# EasyEDA Pro project ProProject_Stc32f_Car副本_2024-06-03.epro, schematic stc32g
Create Date: 2024-04-19; Page Name: P1; Project Name: Stc32f_Car; Schematic Name: STC32G; Update Date: 2024-04-19; Company: 嘉立创EDA; Page Size: A4; Version: V1.0
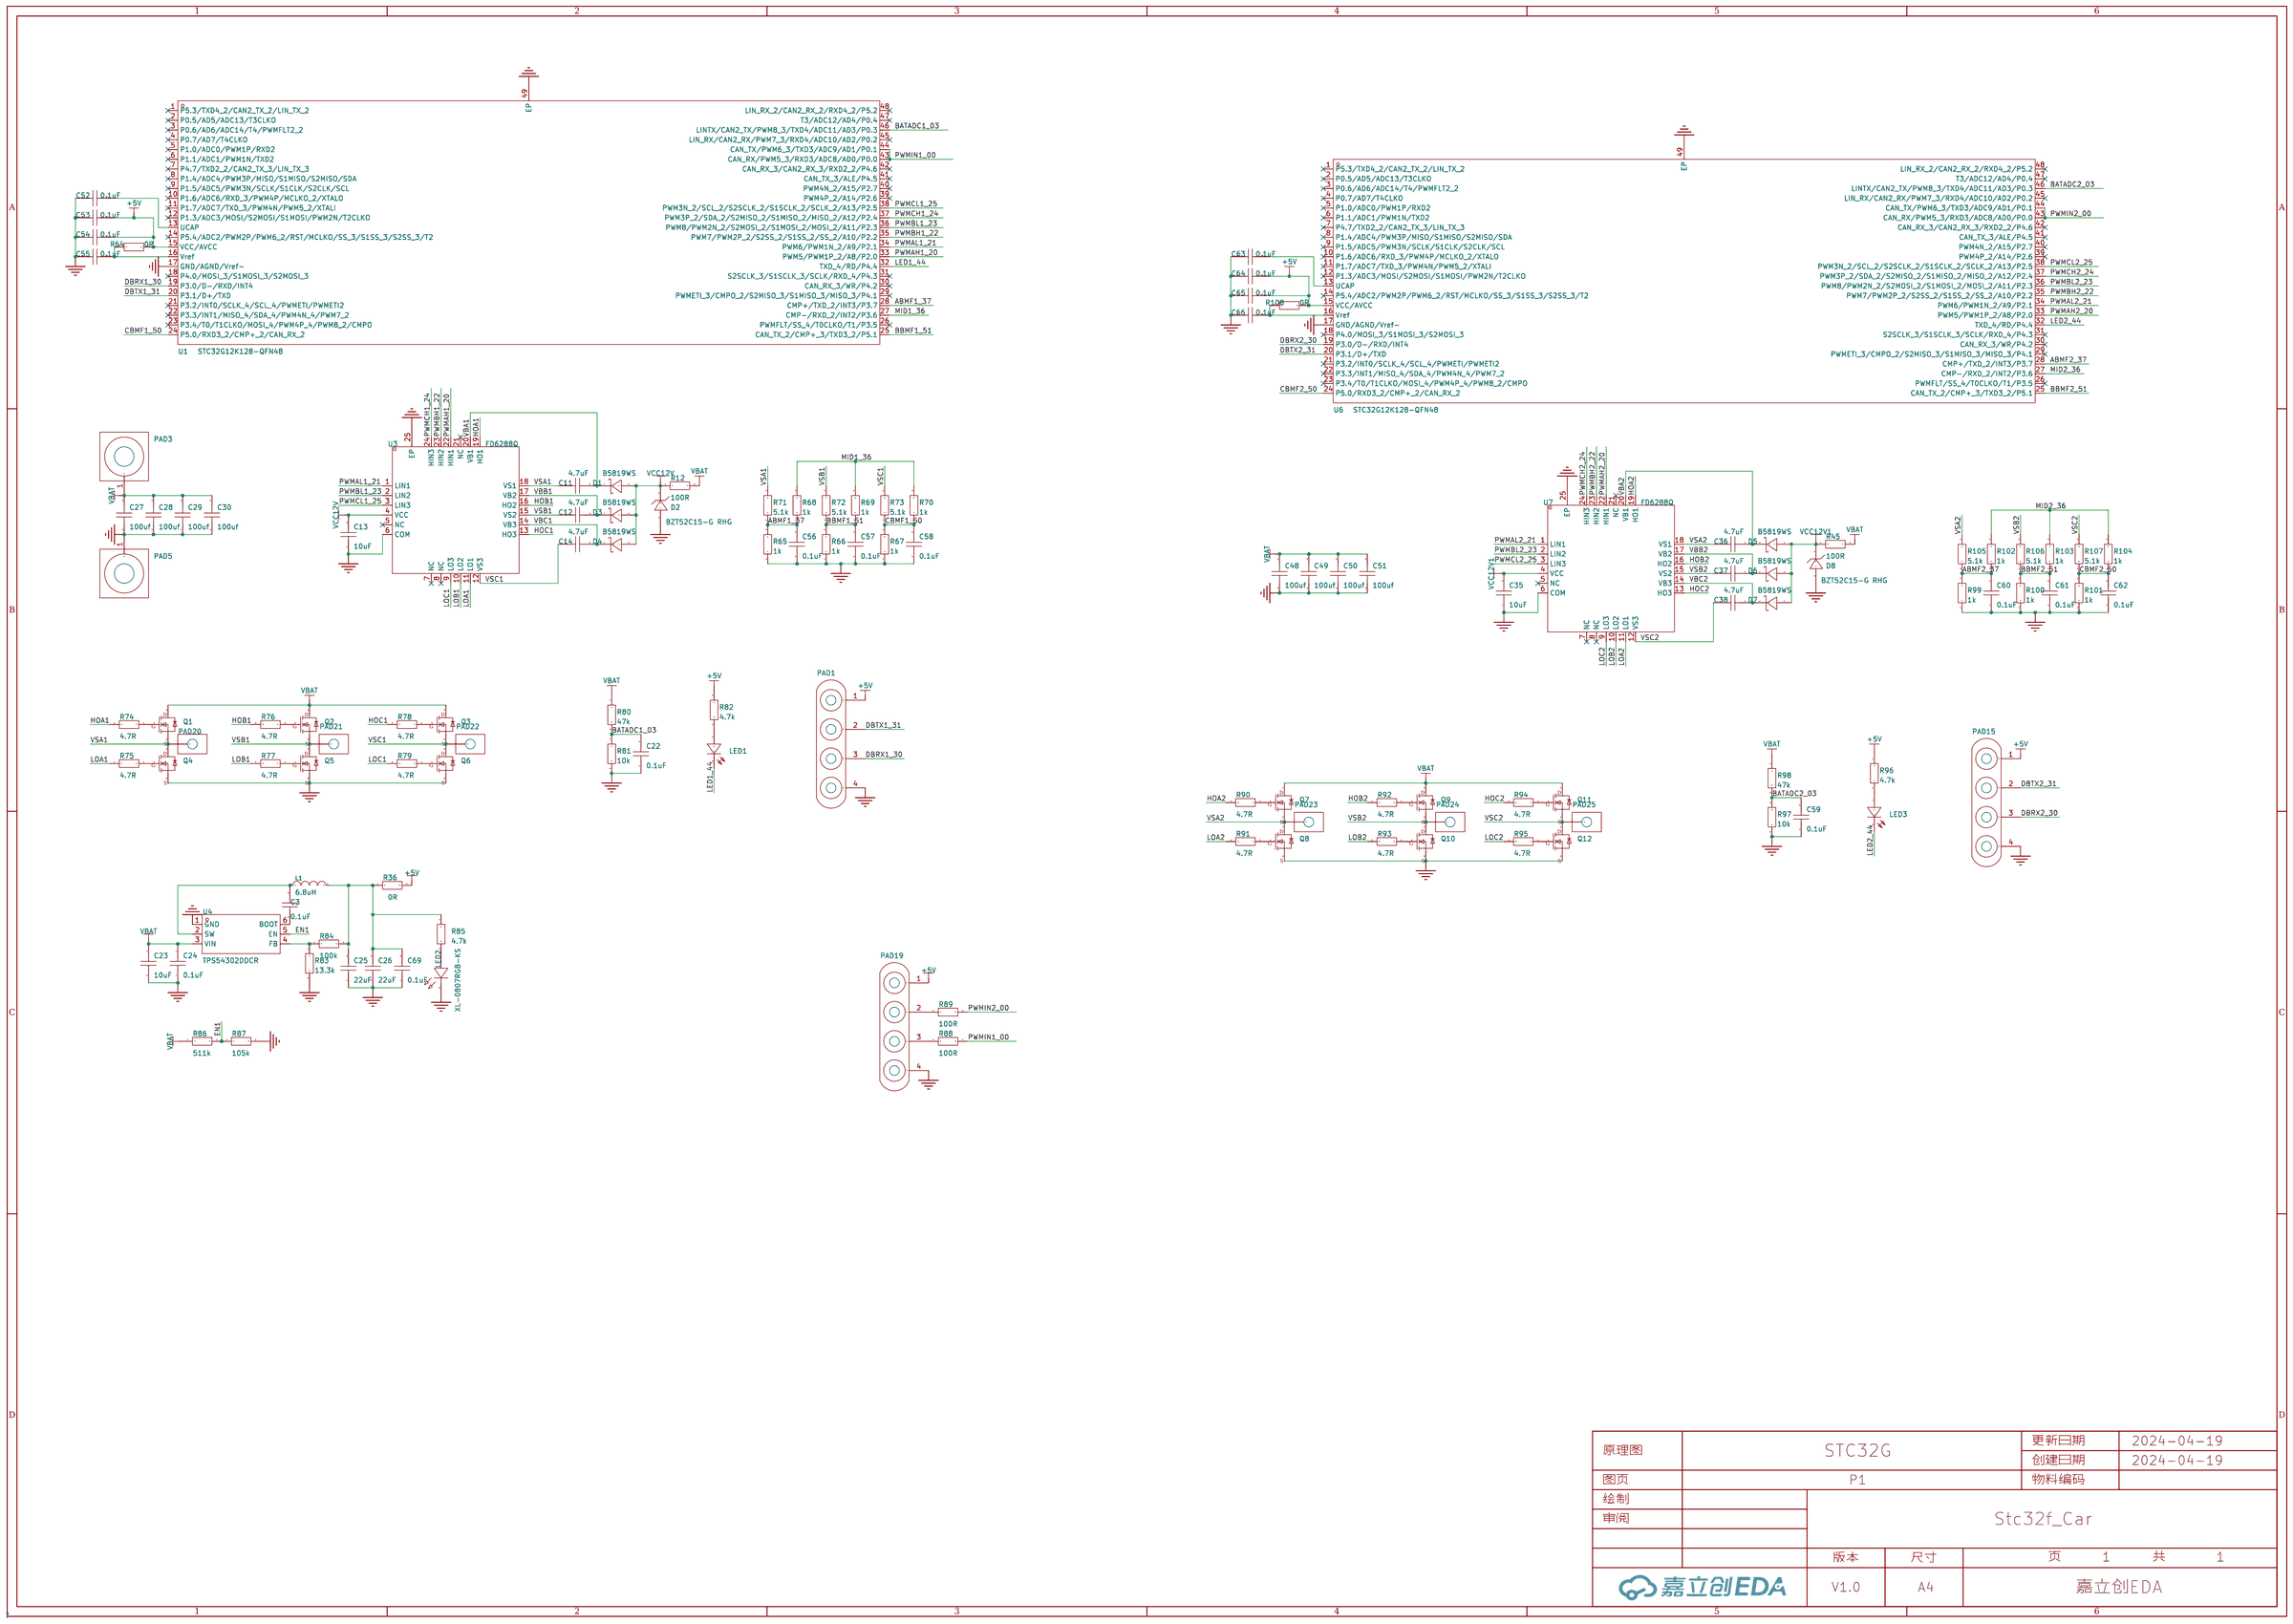
[diagram p9: schematic sheet]

## Parts
C3  0.1uF  [CAPC1005[0402]S-N]
C11  4.7uF  [CAPC1608[0603]S-N_1]
C12  4.7uF  [CAPC1608[0603]S-N_1]
C13  10uF  [CAPC1608[0603]S-N_1]
C14  4.7uF  [CAPC1608[0603]S-N_1]
C22  0.1uF  [CAPC1005[0402]S-N]
C23  10uF  [C 0603_M]
C24  0.1uF  [CAPC1005[0402]S-N]
C25  22uF  [C 0805_M]
C26  22uF  [C 0805_M]
C27  100uf  [C1210]
C28  100uf  [C1210]
C29  100uf  [C1210]
C30  100uf  [C1210]
C35  10uF  [CAPC1608[0603]S-N_1]
C36  4.7uF  [CAPC1608[0603]S-N_1]
C37  4.7uF  [CAPC1608[0603]S-N_1]
C38  4.7uF  [CAPC1608[0603]S-N_1]
C48  100uf  [C1210]
C49  100uf  [C1210]
C50  100uf  [C1210]
C51  100uf  [C1210]
C52  0.1uF  [CAPC1005[0402]S-N]
C53  0.1uF  [CAPC1005[0402]S-N]
C54  0.1uF  [CAPC1005[0402]S-N]
C55  0.1uF  [CAPC1005[0402]S-N]
C56  0.1uF  [CAPC1005[0402]S-N]
C57  0.1uF  [CAPC1005[0402]S-N]
C58  0.1uF  [CAPC1005[0402]S-N]
C59  0.1uF  [CAPC1005[0402]S-N]
C60  0.1uF  [CAPC1005[0402]S-N]
C61  0.1uF  [CAPC1005[0402]S-N]
C62  0.1uF  [CAPC1005[0402]S-N]
C63  0.1uF  [CAPC1005[0402]S-N]
C64  0.1uF  [CAPC1005[0402]S-N]
C65  0.1uF  [CAPC1005[0402]S-N]
C66  0.1uF  [CAPC1005[0402]S-N]
C69  0.1uF  [CAPC1005[0402]S-N]
D1  B5819WS  [SOD-323_L1.8-W1.3-LS2.5-RD]
D2  BZT52C15-G RHG  [SOD-123_L2.8-W1.8-LS3.7-RD]
D3  B5819WS  [SOD-323_L1.8-W1.3-LS2.5-RD]
D4  B5819WS  [SOD-323_L1.8-W1.3-LS2.5-RD]
D5  B5819WS  [SOD-323_L1.8-W1.3-LS2.5-RD]
D6  B5819WS  [SOD-323_L1.8-W1.3-LS2.5-RD]
D7  B5819WS  [SOD-323_L1.8-W1.3-LS2.5-RD]
D8  BZT52C15-G RHG  [SOD-123_L2.8-W1.8-LS3.7-RD]
L1  6.8uH  [L1008]
LED1  77fc373f7f6b4e3da7045e8b6ad0bd9c  [LED Chip]
LED2  XL-0807RGB-KS  [LED-SMD_L2.0-W1.8-R-RD]
LED3  77fc373f7f6b4e3da7045e8b6ad0bd9c  [LED Chip]
PAD1  -  [小焊盘4pin]
PAD3  -  [外置焊盘]
PAD5  -  [外置焊盘]
PAD15  -  [小焊盘4pin]
PAD19  -  [HDR1X4-TP]
PAD20  -  [WirePad-4x6 bottom]
PAD21  -  [WirePad-4x6 bottom]
PAD22  -  [WirePad-4x6 bottom]
PAD23  -  [WirePad-4x6 bottom]
PAD24  -  [WirePad-4x6 bottom]
PAD25  -  [WirePad-4x6 bottom]
Q1  -  [MLPAK33-8_L3.2-W3.0-P0.65-LS3.3-BL]
Q2  -  [MLPAK33-8_L3.2-W3.0-P0.65-LS3.3-BL]
Q3  -  [MLPAK33-8_L3.2-W3.0-P0.65-LS3.3-BL]
Q4  -  [MLPAK33-8_L3.2-W3.0-P0.65-LS3.3-BL]
Q5  -  [MLPAK33-8_L3.2-W3.0-P0.65-LS3.3-BL]
Q6  -  [MLPAK33-8_L3.2-W3.0-P0.65-LS3.3-BL]
Q7  -  [MLPAK33-8_L3.2-W3.0-P0.65-LS3.3-BL]
Q8  -  [MLPAK33-8_L3.2-W3.0-P0.65-LS3.3-BL]
Q9  -  [MLPAK33-8_L3.2-W3.0-P0.65-LS3.3-BL]
Q10  -  [MLPAK33-8_L3.2-W3.0-P0.65-LS3.3-BL]
Q11  -  [MLPAK33-8_L3.2-W3.0-P0.65-LS3.3-BL]
Q12  -  [MLPAK33-8_L3.2-W3.0-P0.65-LS3.3-BL]
R12  100R  [RESC1608[0603]S-N_1]
R36  0R  [R 0805_M_1]
R45  100R  [RESC1608[0603]S-N_1]
R64  0R  [RESC1005[0402]S-N]
R65  1k  [RESC1005[0402]S-N]
R66  1k  [RESC1005[0402]S-N]
R67  1k  [RESC1005[0402]S-N]
R68  1k  [RESC1005[0402]S-N]
R69  1k  [RESC1005[0402]S-N]
R70  1k  [RESC1005[0402]S-N]
R71  5.1k  [RESC1005[0402]S-N]
R72  5.1k  [RESC1005[0402]S-N]
R73  5.1k  [RESC1005[0402]S-N]
R74  4.7R  [RESC1005[0402]S-N]
R75  4.7R  [RESC1005[0402]S-N]
R76  4.7R  [RESC1005[0402]S-N]
R77  4.7R  [RESC1005[0402]S-N]
R78  4.7R  [RESC1005[0402]S-N]
R79  4.7R  [RESC1005[0402]S-N]
R80  47k  [RESC1005[0402]S-N]
R81  10k  [RESC1005[0402]S-N]
R82  4.7k  [RESC1005[0402]S-N]
R83  13.3k  [RESC1005[0402]S-N]
R84  100k  [RESC1005[0402]S-N]
R85  4.7k  [RESC1005[0402]S-N]
R86  511k  [RESC1005[0402]S-N]
R87  105k  [RESC1005[0402]S-N]
R88  100R  [RESC1005[0402]S-N]
R89  100R  [RESC1005[0402]S-N]
R90  4.7R  [RESC1005[0402]S-N]
R91  4.7R  [RESC1005[0402]S-N]
R92  4.7R  [RESC1005[0402]S-N]
R93  4.7R  [RESC1005[0402]S-N]
R94  4.7R  [RESC1005[0402]S-N]
R95  4.7R  [RESC1005[0402]S-N]
R96  4.7k  [RESC1005[0402]S-N]
R97  10k  [RESC1005[0402]S-N]
R98  47k  [RESC1005[0402]S-N]
R99  1k  [RESC1005[0402]S-N]
R100  1k  [RESC1005[0402]S-N]
R101  1k  [RESC1005[0402]S-N]
R102  1k  [RESC1005[0402]S-N]
R103  1k  [RESC1005[0402]S-N]
R104  1k  [RESC1005[0402]S-N]
R105  5.1k  [RESC1005[0402]S-N]
R106  5.1k  [RESC1005[0402]S-N]
R107  5.1k  [RESC1005[0402]S-N]
R108  0R  [RESC1005[0402]S-N]
U1  STC32G12K128-QFN48  [QFN-48_L6.0-W6.0-P0.40-TL-EP4.1]
U3  FD6288Q  [QFN-24_L4.0-W4.0-P0.50-BL-EP2.6]
U4  TPS54302DDCR  [SOT-23-6_L2.9-W1.6-P0.95-LS2.8-BL]
U6  STC32G12K128-QFN48  [QFN-48_L6.0-W6.0-P0.40-TL-EP4.1]
U7  FD6288Q  [QFN-24_L4.0-W4.0-P0.50-BL-EP2.6]

## Library data of the parts
C3 C22 C24 C52-C66 C69 = C_0402L
C11-C14 C35-C38 = C_0603L
C23 = C_0603: Published: 2020-12-18; Revision: V1.1; Tolerance: ±10%; Voltage: 50V; Origin Footprint 2: CAPC1310[0504]S; Origin Footprint 3: CAPC3216[1206]S; Origin Footprint 4: CAPC3225[1210]S; Origin Footprint 5: CAPC4532[1812]S; Origin Footprint 6: CAPC4564[1825]S; Origin Footprint 7: CAPC2012[0805]; Origin Footprint 8: CAPC3216[1206]; Origin Footprint 9: CAPC3225[1210]; Origin Footprint 10: CAPC4532[1812]; Origin Footprint 11: CAPC4564[1825]; Origin Footprint 12: CAPC1608[0603]-N; Origin Footprint 13: CAPC1608[0603]-L; Origin Footprint 14: CAPC1608[0603]-M; Origin Footprint 15: CAPC1608[0603]S-L; Origin Footprint 16: CAPC1608[0603]S-M; Origin Footprint 17: CAPC1608[0603]S-N; Origin Footprint 18: CAPC1005[0402]-L; Origin Footprint 19: CAPC1005[0402]-M; Origin Footprint 20: CAPC1005[0402]-N; Origin Footprint 21: CAPC1005[0402]S-L; Origin Footprint 22: CAPC1005[0402]S-M; Origin Footprint 23: CAPC1005[0402]S-N; Origin Footprint 24: CAPC2012[0805]S-L; Origin Footprint 25: CAPC2012[0805]S-M; Origin Footprint 26: CAPC2012[0805]S-N
C25 C26 = C_0805
C27-C30 C48-C51 = 1210: Supplier Part: C9900018278; JLCPCB Part Class: 扩展库; Supplier: LCSC
D1 D3-D7 = B5819WS_C64886: 直流反向耐压(Vr):40V;平均整流电流(Io):1A;正向压降(Vf):600mV@1A;; LCSC Part Name: B5819WS SL; Supplier Part: C64886; Manufacturer: MDD; Supplier Footprint: SOD-323; JLCPCB Part Class: 扩展库; Datasheet: https://atta.szlcsc.com/upload/public/pdf/source/20190305/C64886_1F90AE208F3ADE51A810479320F68578.pdf; Supplier: LCSC; Reverse Voltage (Vr): 40V; Average Rectified Current (Io): 1A; Forward Voltage (Vf@If): 600mV@1A
D2 D8 = BZT52C15-G RHG: 二极管配置:独立式;稳压值(标称值):15V;稳压值(范围):13.8V~15.6V;精度:±5%;功率:350mW;; Supplier Part: C410856; Manufacturer: Taiwan Semiconductor(台湾半导体); Supplier Footprint: SOD-123; JLCPCB Part Class: 扩展库; Datasheet: https://atta.szlcsc.com/upload/public/pdf/source/20190812/C410856_5A99560BF0F7FC33003834DE7705F091.pdf; Supplier: LCSC; Diode Configuration: 独立式; Zener Voltage (Nom): 15V; Zener Voltage (Range): 13.8V~15.6V; Tolerance: ±5%; Power Dissipation: 350mW; Reverse Leakage Current (Ir): 100nA@10.5V; Zener Impedance (Zzt): 30Ω
L1 = LQM2HPN2R2MG0L: 额定电流:1.3A;电感值:2.2uH;精度:±20%;直流电阻(DCR):100mΩ;; LCSC Part Name: 2.2uH ±20%; Supplier Part: C86092; Manufacturer: muRata(村田); Supplier Footprint: 1008; JLCPCB Part Class: 扩展库; Supplier: LCSC; Rated Current: 1.3A; Tolerance: ±20%; DC Resistance (DCR): 100mΩ
LED1 LED3 = LED Chip: Published: 8-Jun-2000; Revision: July-2002: Re-released for DXP Platform.; Publisher: Altium Limited; Price(RMB): 0.00; Origin Footprint 2: LEDC1608(0603); Origin Footprint 3: LEDC2012(0805); Origin Footprint 4: LEDC3216(1206); Origin Footprint 5: LEDC2012(0805)-L; Origin Footprint 6: LEDC3216(1204); Origin Footprint 7: LEDC3528-2
LED2 = XL-0807RGB-KS: 发光颜色:RGB三色;二极管配置:-;主波长:510nm~525nm；463nm~473nm；620nm~625nm;色温:6000K~6500K;功率:-;安装方式:正贴;; LCSC Part Name: RGB三色 正贴 色温6000K~6500K 快闪 停产; Supplier Part: C965894; Manufacturer: XINGLIGHT(成兴光); Supplier Footprint: SMD,1.8x2mm; JLCPCB Part Class: 扩展库; Datasheet: https://atta.szlcsc.com/upload/public/pdf/source/20221102/EF66E4764A6E96A91069A6ED137C52FB.pdf; Supplier: LCSC; Emitted Color: RGB三色; Lens Color: 无色透明; Dominant Wavelength: 510nm~525nm；463nm~473nm；620nm~625nm; Peak Wavelength: 525nm；625nm；473nm; Color Temperature: 6000K~6500K; Forward Current: 60mA; Viewing Angle: 120°; Mounting Sytle: 正贴; Operating Temperature: -25℃~+60℃
PAD1 PAD15 PAD19 = 小焊盘4pin
PAD3 PAD5 = 外置焊盘
PAD20-PAD25 = 电机焊盘
Q1-Q12 = NMOS-MLPAK(3.3x3.3): PXN8R3-30QLJ; Origin Footprint 2: DFN5x6; Origin Footprint 3: CSD18537NQ5A
R12 R45 = R_0603: BOM____: 贴片电阻; Origin Footprint 2: R 0603_M; Origin Footprint 3: R 0805_M
R36 = R_0805: BOM____: 贴片电阻; Origin Footprint 2: R 0603_M; Origin Footprint 3: R 0805_M
R64-R108 = R_0402L
U1 U6 = STC32G12K128-QFN48: Supplier Part: C9900073965; Supplier Footprint: QFN48_6X6mm; JLCPCB Part Class: 扩展库; Supplier: LCSC
U3 U7 = FD6288Q: Supplier Part: C328453; Manufacturer: Fortior Tech(峰岹); Supplier Footprint: QFN-24-EP(4x4); JLCPCB Part Class: 扩展库; Datasheet: https://atta.szlcsc.com/upload/public/pdf/source/20181108/C328453_785547738DB9FC0123219FC22539EFAD.pdf; Supplier: LCSC; NO_CONNECT: yes
U4 = TPS54302DDCR: 功能类型:降压型;输出类型:可调;输入电压:4.5V~28V;输出电压:596mV~28V;输出电流(最大值):3A;; LCSC Part Name: 降压型 输入4.5V~28V 输出596mV~28V 3A; Supplier Part: C311983; Manufacturer: TI(德州仪器); Supplier Footprint: TSOT-23-6; JLCPCB Part Class: 扩展库; Datasheet: https://atta.szlcsc.com/upload/public/pdf/source/20181023/C311983_0948EE70BFAD2011B492BD3F4CEA709D.pdf; Supplier: LCSC; Function: 降压型; Synchronous Rectification: 是; Output Type: 可调; Number of Outputs: 1; Topology: 降压式; Input Voltage: 4.5V~28V; Output Voltage: 596mV~28V; Output Current (Max): 3A; Switching Frequency: 400kHz; Operating Temperature: -40℃~+125℃@(TJ)

## Nets
+5V: C53.2 C54.2 C64.2 C65.2 PAD1.1 PAD15.1 PAD19.1 R36.2 R64.2 R82.1 R96.1 R108.2 U1.15(VCC/AVCC) U6.15(VCC/AVCC)
GND: C13.1 C22.1 C23.2 C24.1 C25.1 C26.1 C27.1 C28.1 C29.1 C30.1 C35.1 C48.1 C49.1 C50.1 C51.1 C52.1 C53.1 C54.1 C55.1 C56.1 C57.1 C58.1 C59.1 C60.1 C61.1 C62.1 C63.1 C64.1 C65.1 C66.1 C69.1 D2.2(A) D8.2(A) LED2.2(A) PAD1.4 PAD5.1 PAD15.4 PAD19.4 Q4.3 Q5.3 Q6.3 Q8.3 Q10.3 Q12.3 R65.1 R66.1 R67.1 R81.2 R83.2 R87.2 R97.2 R99.1 R100.1 R101.1 U1.17(GND/AGND/Vref-) U1.49(EP) U3.6(COM) U3.25(EP) U4.1(GND) U6.17(GND/AGND/Vref-) U6.49(EP) U7.6(COM) U7.25(EP)
VBAT: C23.1 C24.2 C27.2 C28.2 C29.2 C30.2 C48.2 C49.2 C50.2 C51.2 PAD3.1 Q1.1 Q2.1 Q3.1 Q7.1 Q9.1 Q11.1 R12.2 R45.2 R80.1 R86.1 R98.1 U4.3(VIN)
VCC12V: C13.2 D1.2(A) D2.1(C) D3.2(A) D4.2(A) R12.1 U3.4(VCC)
VCC12V1: C35.2 D5.2(A) D6.2(A) D7.2(A) D8.1(C) R45.1 U7.4(VCC)
ABMF1_37: C56.2 R65.2 R68.1 R71.1 U1.28(CMP+/TXD_2/INT3/P3.7)
ABMF2_37: C60.2 R99.2 R102.1 R105.1 U6.28(CMP+/TXD_2/INT3/P3.7)
BATADC1_03: C22.2 R80.2 R81.1 U1.46(LINTX/CAN2_TX/PWM8_3/TXD4/ADC11/AD3/P0.3)
BATADC2_03: C59.2 R97.1 R98.2 U6.46(LINTX/CAN2_TX/PWM8_3/TXD4/ADC11/AD3/P0.3)
BBMF1_51: C57.2 R66.2 R69.1 R72.1 U1.25(CAN_TX_2/CMP+_3/TXD3_2/P5.1)
BBMF2_51: C61.2 R100.2 R103.1 R106.1 U6.25(CAN_TX_2/CMP+_3/TXD3_2/P5.1)
CBMF1_50: C58.2 R67.2 R70.1 R73.1 U1.24(P5.0/RXD3_2/CMP+_2/CAN_RX_2)
CBMF2_50: C62.2 R101.2 R104.1 R107.1 U6.24(P5.0/RXD3_2/CMP+_2/CAN_RX_2)
DBRX1_30: PAD1.3 U1.19(P3.0/D-/RXD/INT4)
DBRX2_30: PAD15.3 U6.19(P3.0/D-/RXD/INT4)
DBTX1_31: PAD1.2 U1.20(P3.1/D+/TXD)
DBTX2_31: PAD15.2 U6.20(P3.1/D+/TXD)
EN1: R86.2 R87.1 U4.5(EN)
HOA1: R74.2 U3.19(HO1)
HOA2: R90.2 U7.19(HO1)
HOB1: R76.2 U3.16(HO2)
HOB2: R92.2 U7.16(HO2)
HOC1: R78.2 U3.13(HO3)
HOC2: R94.2 U7.13(HO3)
LED1_44: LED1.C U1.32(TXD_4/RD/P4.4)
LED2_44: LED3.C U6.32(TXD_4/RD/P4.4)
LOA1: R75.2 U3.11(LO1)
LOA2: R91.2 U7.11(LO1)
LOB1: R77.2 U3.10(LO2)
LOB2: R93.2 U7.10(LO2)
LOC1: R79.2 U3.9(LO3)
LOC2: R95.2 U7.9(LO3)
MID1_36: R68.2 R69.2 R70.2 U1.27(CMP-/RXD_2/INT2/P3.6)
MID2_36: R102.2 R103.2 R104.2 U6.27(CMP-/RXD_2/INT2/P3.6)
PWMAH1_20: U1.33(PWM5/PWM1P_2/A8/P2.0) U3.22(HIN1)
PWMAH2_20: U6.33(PWM5/PWM1P_2/A8/P2.0) U7.22(HIN1)
PWMAL1_21: U1.34(PWM6/PWM1N_2/A9/P2.1) U3.1(LIN1)
PWMAL2_21: U6.34(PWM6/PWM1N_2/A9/P2.1) U7.1(LIN1)
PWMBH1_22: U1.35(PWM7/PWM2P_2/S2SS_2/S1SS_2/SS_2/A10/P2.2) U3.23(HIN2)
PWMBH2_22: U6.35(PWM7/PWM2P_2/S2SS_2/S1SS_2/SS_2/A10/P2.2) U7.23(HIN2)
PWMBL1_23: U1.36(PWM8/PWM2N_2/S2MOSI_2/S1MOSI_2/MOSI_2/A11/P2.3) U3.2(LIN2)
PWMBL2_23: U6.36(PWM8/PWM2N_2/S2MOSI_2/S1MOSI_2/MOSI_2/A11/P2.3) U7.2(LIN2)
PWMCH1_24: U1.37(PWM3P_2/SDA_2/S2MISO_2/S1MISO_2/MISO_2/A12/P2.4) U3.24(HIN3)
PWMCH2_24: U6.37(PWM3P_2/SDA_2/S2MISO_2/S1MISO_2/MISO_2/A12/P2.4) U7.24(HIN3)
PWMCL1_25: U1.38(PWM3N_2/SCL_2/S2SCLK_2/S1SCLK_2/SCLK_2/A13/P2.5) U3.3(LIN3)
PWMCL2_25: U6.38(PWM3N_2/SCL_2/S2SCLK_2/S1SCLK_2/SCLK_2/A13/P2.5) U7.3(LIN3)
PWMIN1_00: R88.2 U1.43(CAN_RX/PWM5_3/RXD3/ADC8/AD0/P0.0) U1.44(CAN_TX/PWM6_3/TXD3/ADC9/AD1/P0.1)
PWMIN2_00: R89.2 U6.43(CAN_RX/PWM5_3/RXD3/ADC8/AD0/P0.0) U6.44(CAN_TX/PWM6_3/TXD3/ADC9/AD1/P0.1)
VBA1: C11.2 D1.1(K) U3.20(VB1)
VBA2: C36.2 D5.1(K) U7.20(VB1)
VBB1: C12.2 D3.1(K) U3.17(VB2)
VBB2: C37.2 D6.1(K) U7.17(VB2)
VBC1: C14.2 D4.1(K) U3.14(VB3)
VBC2: C38.2 D7.1(K) U7.14(VB3)
VSA1: C11.1 PAD20.1 Q1.3 Q4.1 R71.2 U3.18(VS1)
VSA2: C36.1 PAD23.1 Q7.3 Q8.1 R105.2 U7.18(VS1)
VSB1: C12.1 PAD21.1 Q2.3 Q5.1 R72.2 U3.15(VS2)
VSB2: C37.1 PAD24.1 Q9.3 Q10.1 R106.2 U7.15(VS2)
VSC1: C14.1 PAD22.1 Q3.3 Q6.1 R73.2 U3.12(VS3)
VSC2: C38.1 PAD25.1 Q11.3 Q12.1 R107.2 U7.12(VS3)
$1N883: C55.2 R64.1 U1.16(Vref)
$1N885: C52.2 U1.13(UCAP)
$1N4560: R83.1 R84.1 U4.4(FB)
$1N4564: C3.2 L1.1 U4.2(SW)
$1N14099: Q1.2 R74.1
$1N14121: Q4.2 R75.1
$1N14163: Q5.2 R77.1
$1N14165: Q2.2 R76.1
$1N14207: Q6.2 R79.1
$1N14209: Q3.2 R78.1
$1N14280: LED1.A R82.2
$1N14831: Q7.2 R90.1
$1N14833: Q8.2 R91.1
$1N14835: Q10.2 R93.1
$1N14837: Q9.2 R92.1
$1N14839: Q12.2 R95.1
$1N14841: Q11.2 R94.1
$1N14990: LED3.A R96.2
$1N15402: C66.2 R108.1 U6.16(Vref)
$1N15407: C63.2 U6.13(UCAP)
$1N15587: C3.1 U4.6(BOOT)
$1N15591: LED2.1(K) R85.2
$1N15642: C25.2 C26.2 C69.2 L1.2 R36.1 R84.2 R85.1
$1N22824: PAD19.2 R89.1
$1N22826: PAD19.3 R88.1

Not connected (* = marked no-connect by the designer): U1 1(P5.3/TXD4_2/CAN2_TX_2/LIN_TX_2)* 2(P0.5/AD5/ADC13/T3CLKO)* 3(P0.6/AD6/ADC14/T4/PWMFLT2_2)* 4(P0.7/AD7/T4CLKO)* 5(P1.0/ADC0/PWM1P/RXD2)* 6(P1.1/ADC1/PWM1N/TXD2)* 7(P4.7/TXD2_2/CAN2_TX_3/LIN_TX_3)* 8(P1.4/ADC4/PWM3P/MISO/S1MISO/S2MISO/SDA)* 9(P1.5/ADC5/PWM3N/SCLK/S1CLK/S2CLK/SCL)* 10(P1.6/ADC6/RXD_3/PWM4P/MCLKO_2/XTALO)* 11(P1.7/ADC7/TXD_3/PWM4N/PWM5_2/XTALI)* 12(P1.3/ADC3/MOSI/S2MOSI/S1MOSI/PWM2N/T2CLKO)* 14(P5.4/ADC2/PWM2P/PWM6_2/RST/MCLKO/SS_3/S1SS_3/S2SS_3/T2)* 18(P4.0/MOSI_3/S1MOSI_3/S2MOSI_3)* 21(P3.2/INT0/SCLK_4/SCL_4/PWMETI/PWMETI2)* 22(P3.3/INT1/MISO_4/SDA_4/PWM4N_4/PWM7_2)* 23(P3.4/T0/T1CLKO/MOSI_4/PWM4P_4/PWM8_2/CMPO)* 26(PWMFLT/SS_4/T0CLKO/T1/P3.5)* 29(PWMETI_3/CMPO_2/S2MISO_3/S1MISO_3/MISO_3/P4.1)* 30(CAN_RX_3/WR/P4.2)* 31(S2SCLK_3/S1SCLK_3/SCLK/RXD_4/P4.3)* 39(PWM4P_2/A14/P2.6)* 40(PWM4N_2/A15/P2.7)* 41(CAN_TX_3/ALE/P4.5)* 42(CAN_RX_3/CAN2_RX_3/RXD2_2/P4.6)* 45(LIN_RX/CAN2_RX/PWM7_3/RXD4/ADC10/AD2/P0.2)* 47(T3/ADC12/AD4/P0.4)* 48(LIN_RX_2/CAN2_RX_2/RXD4_2/P5.2)*; U3 5(NC)* 7(NC)* 8(NC)* 21(NC)*; U6 1(P5.3/TXD4_2/CAN2_TX_2/LIN_TX_2)* 2(P0.5/AD5/ADC13/T3CLKO)* 3(P0.6/AD6/ADC14/T4/PWMFLT2_2)* 4(P0.7/AD7/T4CLKO)* 5(P1.0/ADC0/PWM1P/RXD2)* 6(P1.1/ADC1/PWM1N/TXD2)* 7(P4.7/TXD2_2/CAN2_TX_3/LIN_TX_3)* 8(P1.4/ADC4/PWM3P/MISO/S1MISO/S2MISO/SDA)* 9(P1.5/ADC5/PWM3N/SCLK/S1CLK/S2CLK/SCL)* 10(P1.6/ADC6/RXD_3/PWM4P/MCLKO_2/XTALO)* 11(P1.7/ADC7/TXD_3/PWM4N/PWM5_2/XTALI)* 12(P1.3/ADC3/MOSI/S2MOSI/S1MOSI/PWM2N/T2CLKO)* 14(P5.4/ADC2/PWM2P/PWM6_2/RST/MCLKO/SS_3/S1SS_3/S2SS_3/T2)* 18(P4.0/MOSI_3/S1MOSI_3/S2MOSI_3)* 21(P3.2/INT0/SCLK_4/SCL_4/PWMETI/PWMETI2)* 22(P3.3/INT1/MISO_4/SDA_4/PWM4N_4/PWM7_2)* 23(P3.4/T0/T1CLKO/MOSI_4/PWM4P_4/PWM8_2/CMPO)* 26(PWMFLT/SS_4/T0CLKO/T1/P3.5)* 29(PWMETI_3/CMPO_2/S2MISO_3/S1MISO_3/MISO_3/P4.1)* 30(CAN_RX_3/WR/P4.2)* 31(S2SCLK_3/S1SCLK_3/SCLK/RXD_4/P4.3)* 39(PWM4P_2/A14/P2.6)* 40(PWM4N_2/A15/P2.7)* 41(CAN_TX_3/ALE/P4.5)* 42(CAN_RX_3/CAN2_RX_3/RXD2_2/P4.6)* 45(LIN_RX/CAN2_RX/PWM7_3/RXD4/ADC10/AD2/P0.2)* 47(T3/ADC12/AD4/P0.4)* 48(LIN_RX_2/CAN2_RX_2/RXD4_2/P5.2)*; U7 5(NC)* 7(NC)* 8(NC)* 21(NC)*
